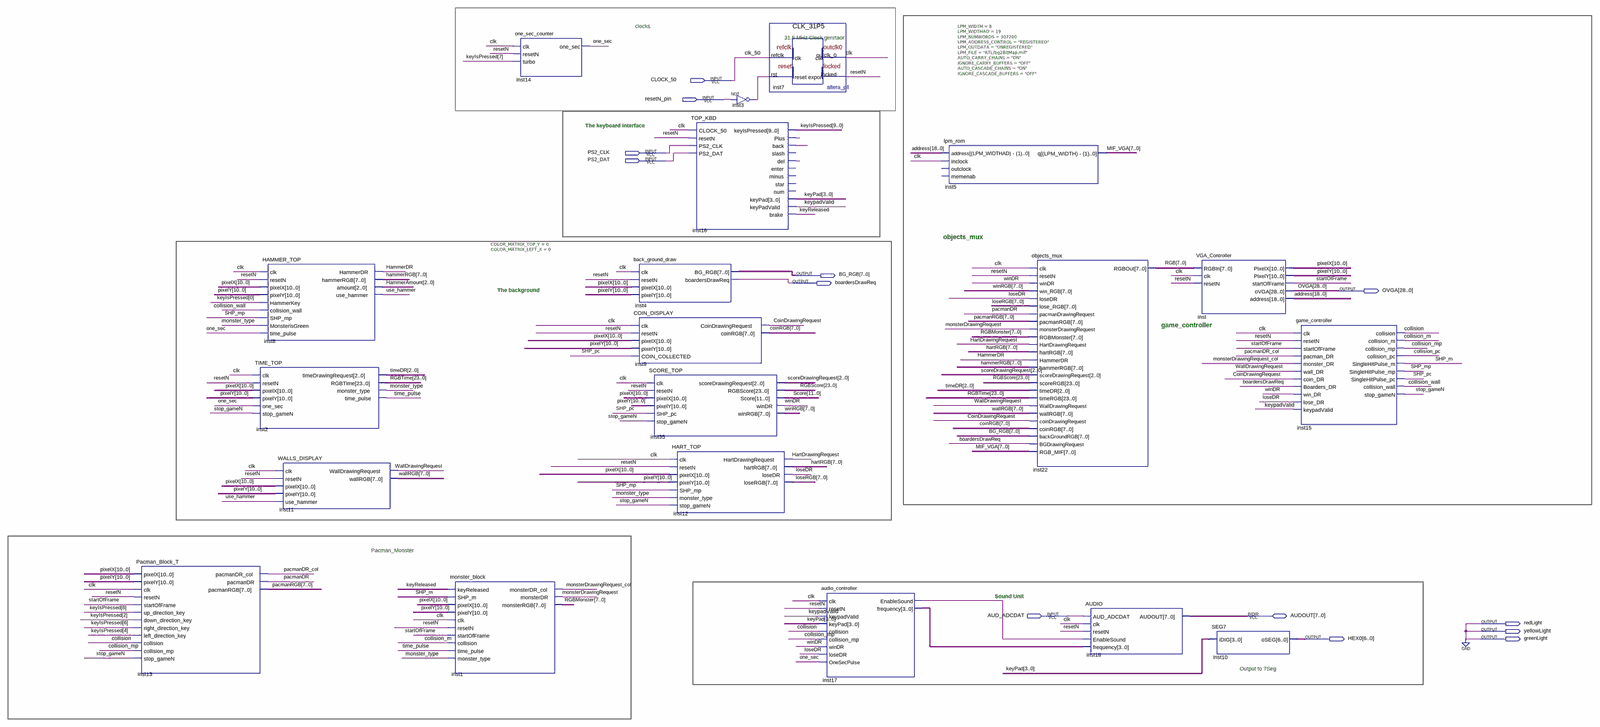
[diagram p0: schematic sheet, whole]
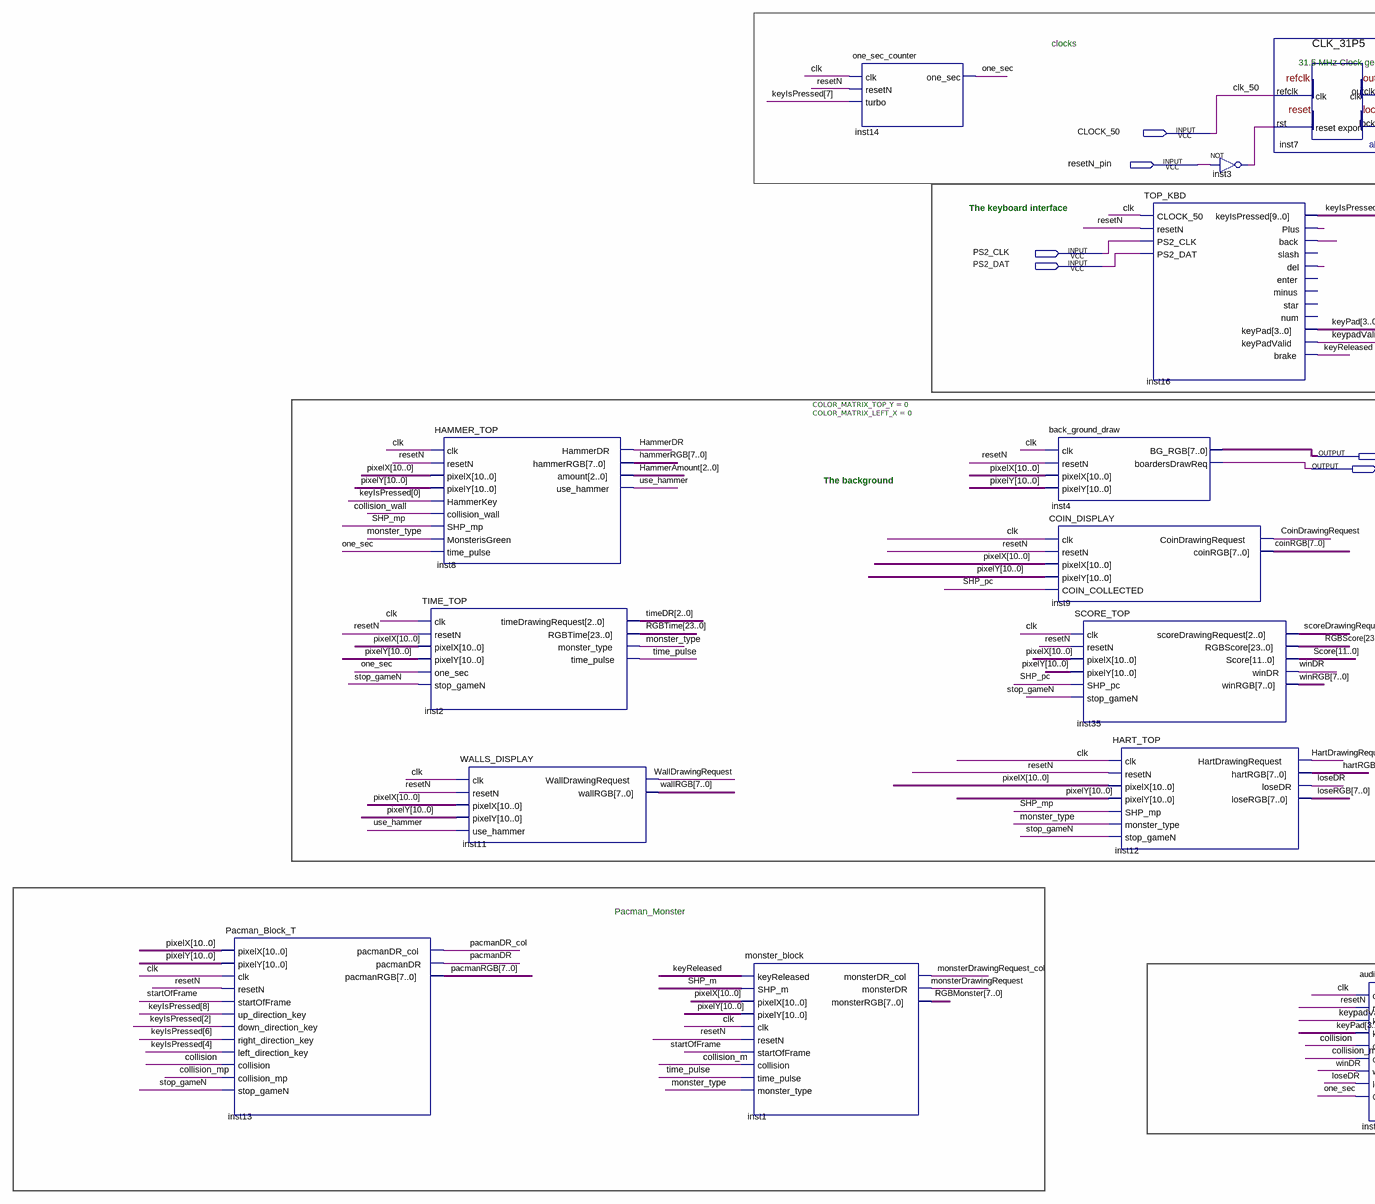
[diagram p1: schematic sheet, left part]
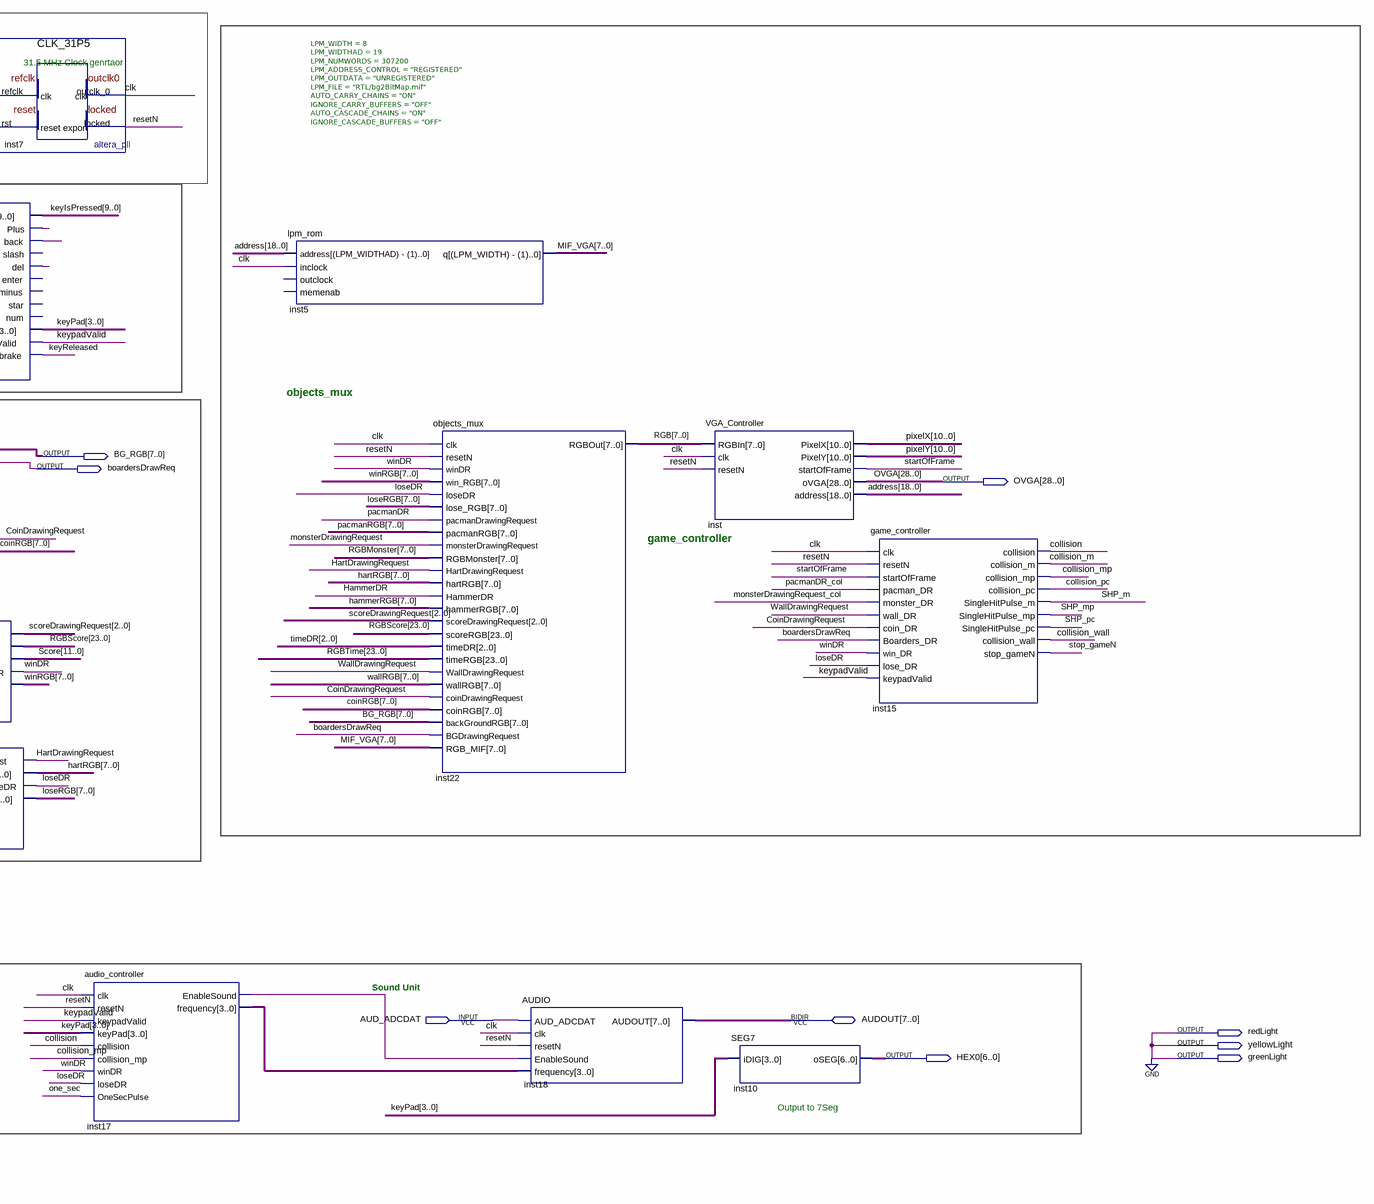
[diagram p2: schematic sheet, right part]
// Quartus schematic TOP_VGA_DEMO_KBD.bdf as structural Verilog: 20 symbols, 13 pins
module TOP_VGA_DEMO_KBD (
  input  CLOCK_50,
  input  resetN_pin,
  input  PS2_CLK,
  input  PS2_DAT,
  input  AUD_ADCDAT,
  inout  [7:0] AUDOUT,
  output [7:0] BG_RGB,
  output boardersDrawReq,
  output [28:0] OVGA,
  output redLight,
  output yellowLight,
  output [6:0] HEX0,
  output greenLight
);

  wire clk, CoinDrawingRequest, collision, collision_m, collision_mp, collision_pc, collision_wall, HammerDR,
       HartDrawingRequest, inst3_out, inst16_back, inst16_del, inst16_plus, inst17_enablesound, keypadValid,
       keyReleased, loseDR, monster_type, monsterDrawingRequest, monsterDrawingRequest_col, one_sec,
       pacmanDR, pacmanDR_col, resetN, SHP_m, SHP_mp, SHP_pc, startOfFrame, stop_gameN, time_pulse,
       use_hammer, WallDrawingRequest, winDR;
  wire [2:0] HammerAmount, scoreDrawingRequest, timeDR;
  wire [3:0] inst17_frequency, keyPad;
  wire [7:0] coinRGB, hammerRGB, hartRGB, loseRGB, MIF_VGA, pacmanRGB, RGB, RGBMonster, wallRGB, winRGB;
  wire [9:0] keyIsPressed;
  wire [10:0] pixelX, pixelY;
  wire [11:0] Score;
  wire [18:0] address;
  wire [23:0] RGBScore, RGBTime;

  Pacman_Block_T inst13 (
    .pixelX(pixelX), .pixelY(pixelY), .clk(clk), .resetN(resetN), .startOfFrame(startOfFrame),
    .up_direction_key(keyIsPressed[8]), .down_direction_key(keyIsPressed[2]),
    .right_direction_key(keyIsPressed[6]), .left_direction_key(keyIsPressed[4]), .collision(collision),
    .collision_mp(collision_mp), .stop_gameN(stop_gameN), .pacmanDR_col(pacmanDR_col), .pacmanDR(pacmanDR),
    .pacmanRGB(pacmanRGB));
  HAMMER_TOP inst8 (
    .clk(clk), .resetN(resetN), .pixelX(pixelX), .pixelY(pixelY), .HammerKey(keyIsPressed[0]),
    .collision_wall(collision_wall), .SHP_mp(SHP_mp), .MonsterisGreen(monster_type), .time_pulse(one_sec),
    .HammerDR(HammerDR), .hammerRGB(hammerRGB), .amount(HammerAmount), .use_hammer(use_hammer));
  TIME_TOP inst2 (
    .clk(clk), .resetN(resetN), .pixelX(pixelX), .pixelY(pixelY), .one_sec(one_sec), .stop_gameN(stop_gameN),
    .timeDrawingRequest(timeDR), .RGBTime(RGBTime), .monster_type(monster_type), .time_pulse(time_pulse));
  WALLS_DISPLAY inst11 (
    .clk(clk), .resetN(resetN), .pixelX(pixelX), .pixelY(pixelY), .use_hammer(use_hammer),
    .WallDrawingRequest(WallDrawingRequest), .wallRGB(wallRGB));
  monster_block inst1 (
    .keyReleased(keyReleased), .SHP_m(SHP_m), .pixelX(pixelX), .pixelY(pixelY), .clk(clk), .resetN(resetN),
    .startOfFrame(startOfFrame), .collision(collision_m), .time_pulse(time_pulse),
    .monster_type(monster_type), .monsterDR_col(monsterDrawingRequest_col),
    .monsterDR(monsterDrawingRequest), .monsterRGB(RGBMonster));
  one_sec_counter inst14 (.clk(clk), .resetN(resetN), .turbo(keyIsPressed[7]), .one_sec(one_sec));
  back_ground_draw #(.COLOR_MATRIX_TOP_Y(0), .COLOR_MATRIX_LEFT_X(0)) inst4 (
    .clk(clk), .resetN(resetN), .pixelX(pixelX), .pixelY(pixelY), .BG_RGB(BG_RGB),
    .boardersDrawReq(boardersDrawReq));
  COIN_DISPLAY inst9 (
    .clk(clk), .resetN(resetN), .pixelX(pixelX), .pixelY(pixelY), .COIN_COLLECTED(SHP_pc),
    .CoinDrawingRequest(CoinDrawingRequest), .coinRGB(coinRGB));
  SCORE_TOP inst35 (
    .clk(clk), .resetN(resetN), .pixelX(pixelX), .pixelY(pixelY), .SHP_pc(SHP_pc), .stop_gameN(stop_gameN),
    .scoreDrawingRequest(scoreDrawingRequest), .RGBScore(RGBScore), .Score(Score), .winDR(winDR),
    .winRGB(winRGB));
  HART_TOP inst12 (
    .clk(clk), .resetN(resetN), .pixelX(pixelX), .pixelY(pixelY), .SHP_mp(SHP_mp),
    .monster_type(monster_type), .stop_gameN(stop_gameN), .HartDrawingRequest(HartDrawingRequest),
    .hartRGB(hartRGB), .loseDR(loseDR), .loseRGB(loseRGB));
  TOP_KBD inst16 (
    .CLOCK_50(clk), .resetN(resetN), .PS2_CLK(PS2_CLK), .PS2_DAT(PS2_DAT), .keyIsPressed(keyIsPressed),
    .Plus(inst16_plus), .back(inst16_back), .del(inst16_del), .keyPad(keyPad), .keyPadValid(keypadValid),
    .brake(keyReleased));  // open: slash, enter, minus, star, num
  not inst3 (inst3_out, resetN_pin);
  CLK_31P5 inst7 (.refclk(CLOCK_50), .rst(inst3_out), .outclk_0(clk), .locked(resetN));
  audio_controller inst17 (
    .clk(clk), .resetN(resetN), .keypadValid(keypadValid), .keyPad(keyPad), .collision(collision),
    .collision_mp(collision_mp), .winDR(winDR), .loseDR(loseDR), .OneSecPulse(one_sec),
    .EnableSound(inst17_enablesound), .frequency(inst17_frequency));
  lpm_rom #(.LPM_WIDTH(8), .LPM_WIDTHAD(19), .LPM_NUMWORDS(307200), .LPM_ADDRESS_CONTROL("REGISTERED"), .LPM_OUTDATA("UNREGISTERED"), .LPM_FILE("RTL/bg2BitMap.mif"), .AUTO_CARRY_CHAINS("ON"), .IGNORE_CARRY_BUFFERS("OFF"), .AUTO_CASCADE_CHAINS("ON"), .IGNORE_CASCADE_BUFFERS("OFF")) inst5 (
    .address(address), .inclock(clk), .q(MIF_VGA));  // open: outclock, memenab
  objects_mux inst22 (
    .clk(clk), .resetN(resetN), .winDR(winDR), .win_RGB(winRGB), .loseDR(loseDR), .lose_RGB(loseRGB),
    .pacmanDrawingRequest(pacmanDR), .pacmanRGB(pacmanRGB), .monsterDrawingRequest(monsterDrawingRequest),
    .RGBMonster(RGBMonster), .HartDrawingRequest(HartDrawingRequest), .hartRGB(hartRGB), .HammerDR(HammerDR),
    .hammerRGB(hammerRGB), .scoreDrawingRequest(scoreDrawingRequest), .scoreRGB(RGBScore), .timeDR(timeDR),
    .timeRGB(RGBTime), .WallDrawingRequest(WallDrawingRequest), .wallRGB(wallRGB),
    .coinDrawingRequest(CoinDrawingRequest), .coinRGB(coinRGB), .backGroundRGB(BG_RGB),
    .BGDrawingRequest(boardersDrawReq), .RGB_MIF(MIF_VGA), .RGBOut(RGB));
  AUDIO inst18 (
    .AUD_ADCDAT(AUD_ADCDAT), .clk(clk), .resetN(resetN), .EnableSound(inst17_enablesound),
    .frequency(inst17_frequency), .AUDOUT(AUDOUT));
  VGA_Controller inst (
    .RGBIn(RGB), .clk(clk), .resetN(resetN), .PixelX(pixelX), .PixelY(pixelY), .startOfFrame(startOfFrame),
    .oVGA(OVGA), .address(address));
  SEG7 inst10 (.iDIG(keyPad), .oSEG(HEX0));
  game_controller inst15 (
    .clk(clk), .resetN(resetN), .startOfFrame(startOfFrame), .pacman_DR(pacmanDR_col),
    .monster_DR(monsterDrawingRequest_col), .wall_DR(WallDrawingRequest), .coin_DR(CoinDrawingRequest),
    .Boarders_DR(boardersDrawReq), .win_DR(winDR), .lose_DR(loseDR), .keypadValid(keypadValid),
    .collision(collision), .collision_m(collision_m), .collision_mp(collision_mp),
    .collision_pc(collision_pc), .SingleHitPulse_m(SHP_m), .SingleHitPulse_mp(SHP_mp),
    .SingleHitPulse_pc(SHP_pc), .collision_wall(collision_wall), .stop_gameN(stop_gameN));

  assign greenLight = 1'b0;
  assign redLight = 1'b0;
  assign yellowLight = 1'b0;

  // Other names for the same wires on the sheet: clk_50 = CLOCK_50

  // Notes on the sheet:
  //   clocks
  //   31.5 MHz Clock genrtaor
  //   The keyboard interface
  //    objects_mux
  //   The background
  //    game_controller
  //   Pacman_Monster
  //   Sound Unit
  //   Output to 7Seg
endmodule
